# EAGLE design dual_encoder_i2c_revA (EAGLE 8.6.0)
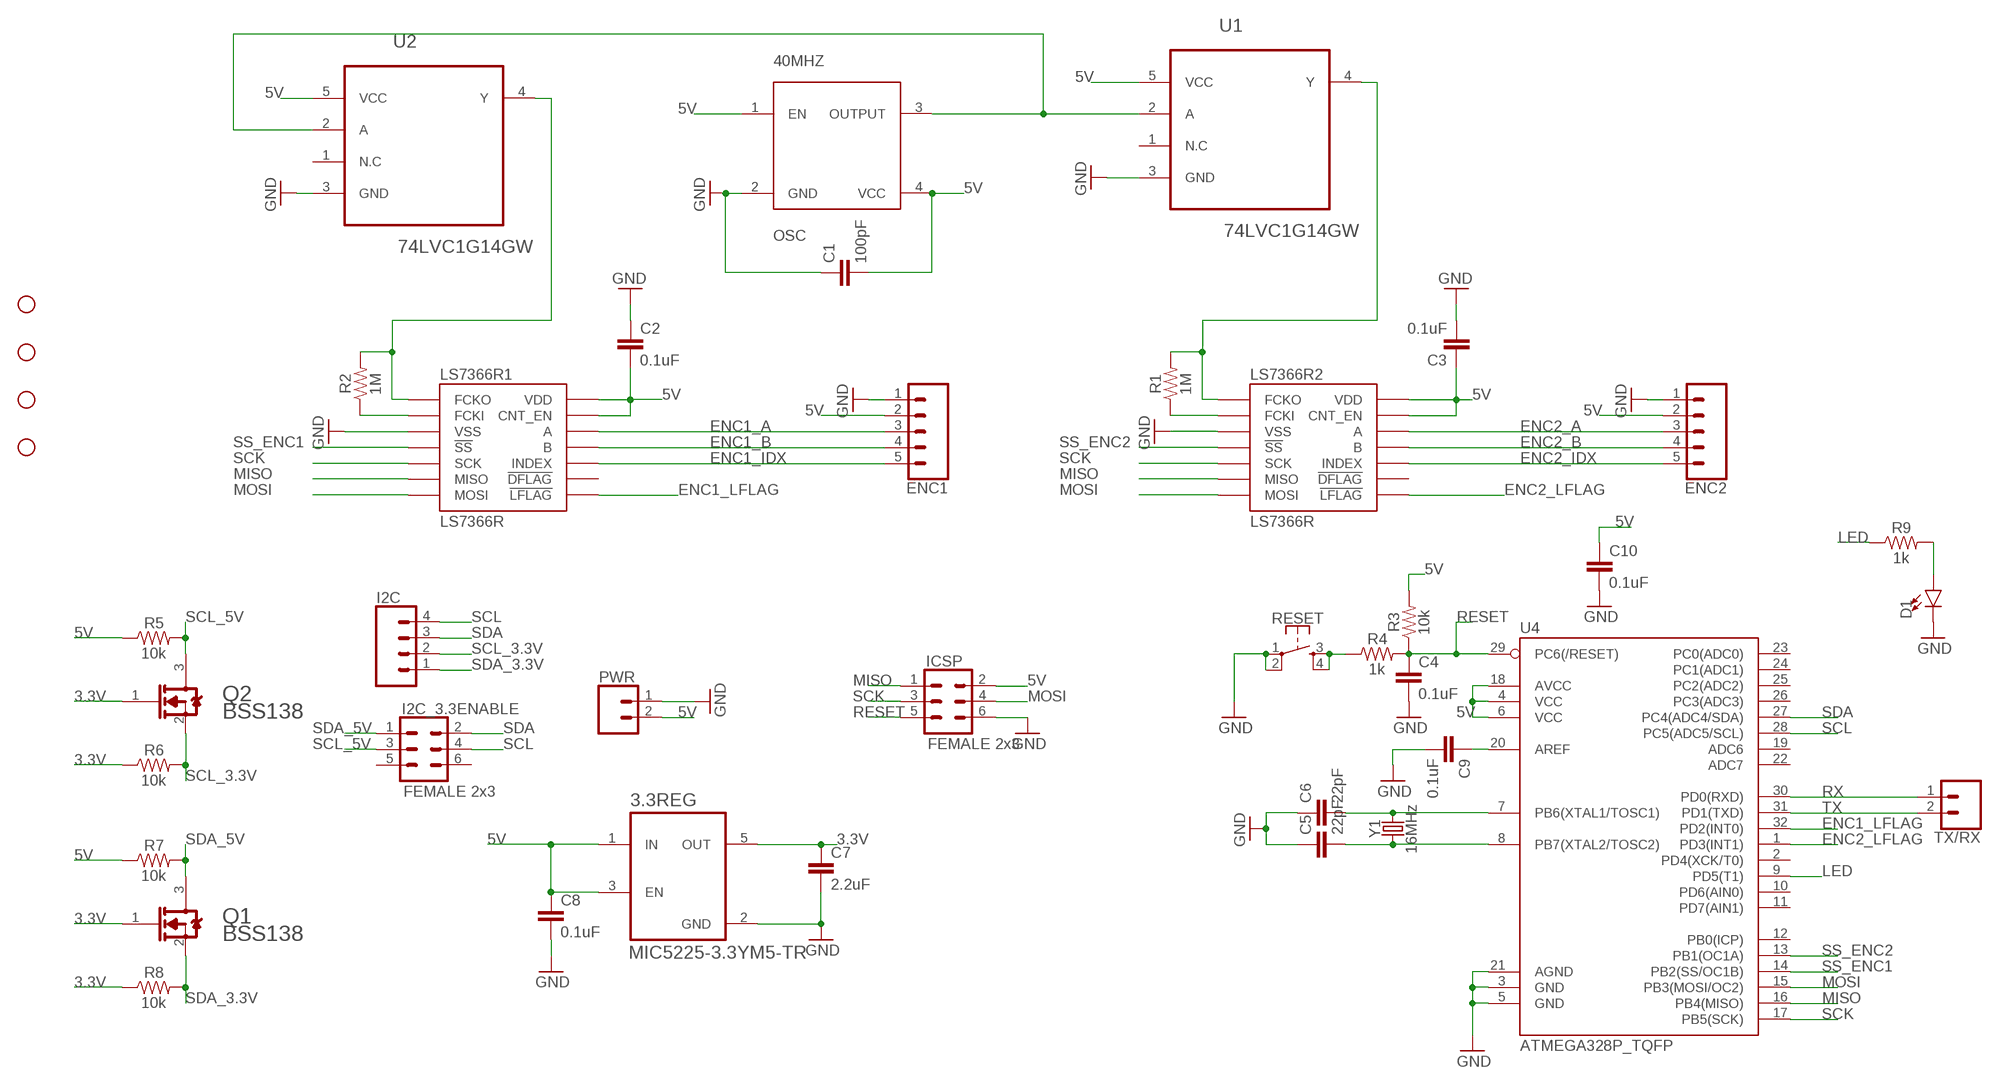
[diagram p0: schematic, sheet 1]

## Parts
3.3REG  MIC5225-3.3YM5-TR  [SOT95P280X145-5N]
40MHZ  OSC  [CB3OSCILLATOR]
C1  100pF  100PF-0603-50V-5%  [0603]
C2  0.1uF  0.1UF-0603-25V-5%  [0603]
C3  0.1uF  0.1UF-0603-25V-5%  [0603]
C4  0.1uF  0.1UF-0603-25V-5%  [0603]
C5  22pF  22PF-0603-50V-5%  [0603]
C6  22pF  22PF-0603-50V-5%  [0603]
C7  2.2uF  2.2UF-0603-10V-20%  [0603]
C8  0.1uF  0.1UF-0603-25V-5%  [0603]
C9  0.1uF  0.1UF-0603-25V-5%  [0603]
C10  0.1uF  0.1UF-0603-25V-5%  [0603]
D1  LED0603  [LED-0603]
ENC1  CONN_05  [1X05]
ENC2  CONN_05  [1X05]
H1  STAND-OFF  [STAND-OFF]
H2  STAND-OFF  [STAND-OFF]
H3  STAND-OFF  [STAND-OFF]
H4  STAND-OFF  [STAND-OFF]
I2C  CONN_04  [1X04]
I2C_3.3ENABLE  FEMALE 2x3  CONN_03X2FEMALE  [2X3]
ICSP  FEMALE 2x3  CONN_03X2FEMALE  [2X3]
LS7366R1  LS7366R  [SOIC14]
LS7366R2  LS7366R  [SOIC14]
PWR  CONN_02-JST-2MM-SMT  [JST-2-SMD]
Q1  ON_SEMI_BSS138ON_SEMI_BSS138_0_0  [ON_SEMI_BSS138_0]
Q2  ON_SEMI_BSS138ON_SEMI_BSS138_0_0  [ON_SEMI_BSS138_0]
R1  1M  1MOHM-0603-1/4W-5%  [0603]
R2  1M  1MOHM-0603-1/4W-5%  [0603]
R3  10k  10KOHM-0603-1/10W-1%  [0603]
R4  1k  1KOHM-0603-1/10W-1%  [0603]
R5  10k  10KOHM-0603-1/10W-1%  [0603]
R6  10k  10KOHM-0603-1/10W-1%  [0603]
R7  10k  10KOHM-0603-1/10W-1%  [0603]
R8  10k  10KOHM-0603-1/10W-1%  [0603]
R9  1k  1KOHM-0603-1/10W-1%  [0603]
RESET  MOMENTARY-SWITCH-SPST-2-SMD-5.2MM  [TACTILE_SWITCH_SMD_5.2MM]
TX/RX  CONN_02  [1X02]
U1  74LVC1G14GW  [SOT65P210X110-5N]
U2  74LVC1G14GW  [SOT65P210X110-5N]
U4  ATMEGA328P_TQFP  [TQFP32-08]
Y1  16MHz  CRYSTAL-16MHZPTH-HC49US  [HC49US]

## Nets
3.3V: 3.3REG.5(OUT) C7.1 Q1.1(G) Q2.1(G) R6.1 R8.1
5V: 3.3REG.1(IN) 3.3REG.3(EN) 40MHZ.1(EN) 40MHZ.4(VCC) C1.2 C2.2 C3.1 C8.1 C10.1 ENC1.2 ENC2.2 ICSP.2 LS7366R1.13(CNT_EN) LS7366R1.14(VDD) LS7366R2.13(CNT_EN) LS7366R2.14(VDD) PWR.2 R3.2 R5.1 R7.1 U1.5(VCC) U2.5(VCC) U4.4(VCC) U4.6(VCC) U4.18(AVCC)
ENC1_A: ENC1.3 LS7366R1.12(A)
ENC1_B: ENC1.4 LS7366R1.11(B)
ENC1_IDX: ENC1.5 LS7366R1.10(INDEX)
ENC1_LFLAG: LS7366R1.8(!LFLAG) U4.32(PD2(INT0))
ENC2_A: ENC2.3 LS7366R2.12(A)
ENC2_B: ENC2.4 LS7366R2.11(B)
ENC2_IDX: ENC2.5 LS7366R2.10(INDEX)
ENC2_LFLAG: LS7366R2.8(!LFLAG) U4.1(PD3(INT1))
GND: 3.3REG.2(GND) 40MHZ.2(GND) C1.1 C2.1 C3.2 C4.2 C5.1 C6.1 C7.2 C8.2 C9.2 C10.2 D1.C ENC1.1 ENC2.1 ICSP.6 LS7366R1.3(VSS) LS7366R2.3(VSS) PWR.1 RESET.1 RESET.2 U1.3(GND) U2.3(GND) U4.3(GND) U4.5(GND) U4.21(AGND)
LED: R9.1 U4.9(PD5(T1))
MISO: ICSP.1 LS7366R1.6(MISO) LS7366R2.6(MISO) U4.16(PB4(MISO))
MOSI: ICSP.4 LS7366R1.7(MOSI) LS7366R2.7(MOSI) U4.15(PB3(MOSI/OC2))
N$1: C9.1 U4.20(AREF)
N$2: R4.1 RESET.3 RESET.4
N$3: D1.A R9.2
N$6: LS7366R1.2(FCKI) R2.1
N$7: 40MHZ.3(OUTPUT) U1.2(A) U2.2(A)
N$8: LS7366R2.1(FCKO) R1.2 U1.4(Y)
N$9: LS7366R2.2(FCKI) R1.1
N$10: LS7366R1.1(FCKO) R2.2 U2.4(Y)
N$12: C6.2 U4.7(PB6(XTAL1/TOSC1)) Y1.2
N$13: C5.2 U4.8(PB7(XTAL2/TOSC2)) Y1.1
RESET: C4.1 ICSP.5 R3.1 R4.2 U4.29(PC6(/RESET))
RX: TX/RX.1 U4.30(PD0(RXD))
SCK: ICSP.3 LS7366R1.5(SCK) LS7366R2.5(SCK) U4.17(PB5(SCK))
SCL: I2C.4 I2C_3.3ENABLE.4 U4.28(PC5(ADC5/SCL))
SCL_3.3V: I2C.2 Q2.2(S) R6.2
SCL_5V: I2C_3.3ENABLE.3 Q2.3(D) R5.2
SDA: I2C.3 I2C_3.3ENABLE.2 U4.27(PC4(ADC4/SDA))
SDA_3.3V: I2C.1 Q1.2(S) R8.2
SDA_5V: I2C_3.3ENABLE.1 Q1.3(D) R7.2
SS_ENC1: LS7366R1.4(!SS) U4.14(PB2(SS/OC1B))
SS_ENC2: LS7366R2.4(!SS) U4.13(PB1(OC1A))
TX: TX/RX.2 U4.31(PD1(TXD))
Unconnected: I2C_3.3ENABLE.5 I2C_3.3ENABLE.6 LS7366R1.9(!DFLAG) LS7366R2.9(!DFLAG) U1.1(N.C) U2.1(N.C) U4.2(PD4(XCK/T0)) U4.10(PD6(AIN0)) U4.11(PD7(AIN1)) U4.12(PB0(ICP)) U4.19(ADC6) U4.22(ADC7) U4.23(PC0(ADC0)) U4.24(PC1(ADC1)) U4.25(PC2(ADC2)) U4.26(PC3(ADC3))

## Library data of the parts
3.3REG = MIC5225-3.3YM5-TR:MIC5225-3.3YM5-TR: MIC5225 Series 150 mA 3.3 V Fixed Output Surface Mount LDO Regulator SOT-23-5; AVAILABILITY: Unavailable; DESCRIPTION: Linear Voltage Regulator IC 1 Output 150mA SOT-23-5; MF: Microchip; MP: MIC5225-3.3YM5-TR; PACKAGE: SOT-23 Microchip; PRICE: None
40MHZ = steveo:OSC: CB3 40mhz Oscillator smd
C1 = SparkFun-Capacitors:100PF: 100pF/0.1nF ceramic capacitors A capacitor is a passive two-terminal electrical component used to store electrical energy temporarily in an electric field.; PROD_ID: CAP-07883
C2-C4 C8-C10 = SparkFun-Capacitors:0.1UF: 0.1µF ceramic capacitors A capacitor is a passive two-terminal electrical component used to store electrical energy temporarily in an electric field.; PROD_ID: CAP-08604
C5 C6 = SparkFun-Capacitors:22PF: 22pF ceramic capacitors A capacitor is a passive two-terminal electrical component used to store electrical energy temporarily in an electric field.; PROD_ID: CAP-07876
C7 = SparkFun-Capacitors:2.2UF: 2.2µF ceramic capacitors A capacitor is a passive two-terminal electrical component used to store electrical energy temporarily in an electric field.; PROD_ID: CAP-07888
D1 = SparkFun-LED:LED: LED (Generic) Standard schematic elements and footprints for 5mm, 3mm, 1206, and 0603 sized LEDs. Generic LEDs with no color specified.
ENC1 ENC2 = SparkFun-Connectors:CONN_05: Multi connection point. Often used as Generic Header-pin footprint for 0.1 inch spaced/style header connections On any of the 0.1 inch spaced packages, you can populate with these: Break Away Headers - Straight <https://www.sparkfun.com/products/116> (PRT-00116) Break Away Male Headers - Right Angle <https://www.sparkfun.com/products/553> (PRT-00553) Female Headers <https://www.sparkfun.com/products/115> (PRT-00115) Break Away Headers - Machine Pin <https://www.sparkfun.com/products/117> (PRT-00117) Break Away Female Headers - Swiss Machine Pin <https://www.sparkfun.com/products/743> (PRT-00743) For SCREWTERMINALS and SPRING TERMINALS visit here: Screw Terimnals on SparkFun.com <https://www.sparkfun.com/search/results?term=Screw+Terminals> (5mm/3.5mm/2.54mm spacing) This device is also useful as a general connection point to wire up your design to another part of your project. Our various solder wires solder well into these plated through hole pads. Hook-Up Wire - Assortment (Stranded, 22 AWG) <https://www.sparkfun.com/products/11375> (PRT-11375) Hook-Up Wire - Assortment (Solid Core, 22 AWG) <https://www.sparkfun.com/products/11367> (PRT-11367) View the entire wire category on our website here <https://www.sparkfun.com/categories/141> Special notes: Molex polarized connector foot print use with SKU : PRT-08231 with associated crimp pins and housings. 1MM SMD Version SKU: PRT-10208
H1-H4 = SparkFun-Hardware:STAND-OFF: Stand Off Drill holes for mechanically mounting via screws, standoffs, etc. Note: Use the keepout ring to avoid running the screw head into surrounding components. Variant Overviews STAND-OFF - Mechanical footprint for a #4 phillips button head screw. STAND-OFF-TIGHT - Mechanical footprint for a #4 phillips button head screw, Example SparkFun Products Screw - Phillips Head (1/4", 4-40, 10 pack) <https://www.sparkfun.com/products/10453> (PRT-10453) Screw - Phillips Head (1/2", 4-40, 10 pack) <https://www.sparkfun.com/products/10452> (PRT-10452) Screw - Phillips Head (3/4", 4-40, 10 pack) <https://www.sparkfun.com/products/10451> (PRT-10451) Screw - Phillips Head (1", 4-40, 10 pack) <https://www.sparkfun.com/products/10450> (PRT-10450)
I2C = SparkFun-Connectors:CONN_04: Multi connection point. Often used as Generic Header-pin footprint for 0.1 inch spaced/style header connections On any of the 0.1 inch spaced packages, you can populate with these: Break Away Headers - Straight <https://www.sparkfun.com/products/116> (PRT-00116) Break Away Male Headers - Right Angle <https://www.sparkfun.com/products/553> (PRT-00553) Female Headers <https://www.sparkfun.com/products/115> (PRT-00115) Break Away Headers - Machine Pin <https://www.sparkfun.com/products/117> (PRT-00117) Break Away Female Headers - Swiss Machine Pin <https://www.sparkfun.com/products/743> (PRT-00743) For SCREWTERMINALS and SPRING TERMINALS visit here: Screw Terimnals on SparkFun.com <https://www.sparkfun.com/search/results?term=Screw+Terminals> (5mm/3.5mm/2.54mm spacing) This device is also useful as a general connection point to wire up your design to another part of your project. Our various solder wires solder well into these plated through hole pads. Hook-Up Wire - Assortment (Stranded, 22 AWG) <https://www.sparkfun.com/products/11375> (PRT-11375) Hook-Up Wire - Assortment (Solid Core, 22 AWG) <https://www.sparkfun.com/products/11367> (PRT-11367) View the entire wire category on our website here <https://www.sparkfun.com/categories/141> Special notes: Molex polarized connector foot print use with SKU : PRT-08231 with associated crimp pins and housings. 1MM SMD Version SKU: PRT-10208; PROD_ID: CONN-09696
I2C_3.3ENABLE ICSP = SparkFun-Connectors:CONN_03X2: Multi connection point. Often used as Generic Header-pin footprint for 0.1 inch spaced/style header connections You can populate with any combo of single row headers, but if you'd like an exact match, check these: Header - 2x3 (Male, 0.1") <https://www.sparkfun.com/products/12807> (PRT-12807) Header - 2x3 (Female, 0.1") <https://www.sparkfun.com/products/13010> (PRT-13010) 2x3 Pin Shrouded Header <https://www.sparkfun.com/products/10877> (PRT-10877) On any of the 0.1 inch spaced packages, you can populate with these: Break Away Headers - Straight <https://www.sparkfun.com/products/116> (PRT-00116) Break Away Male Headers - Right Angle <https://www.sparkfun.com/products/553> (PRT-00553) Female Headers <https://www.sparkfun.com/products/115> (PRT-00115) Break Away Headers - Machine Pin <https://www.sparkfun.com/products/117> (PRT-00117) Break Away Female Headers - Swiss Machine Pin <https://www.sparkfun.com/products/743> (PRT-00743) Special note: the shrouded connector mates well with our 3x2 ribbon cables: Ribbon Crimp Connector - 6-pin (2x3, Female) <https://www.sparkfun.com/products/10651> (PRT-10651) Ribbon Cable - 6 wire (15ft) <https://www.sparkfun.com/products/10646> (PRT-10646); PROD_ID: CONN-11566
LS7366R1 LS7366R2 = LS7366R:LS7366R; AVAILABILITY: Unavailable; MF: LSI; MP: LS7366R; PACKAGE: None; PRICE: None
PWR = SparkFun-Connectors:CONN_02: Multi connection point. Often used as Generic Header-pin footprint for 0.1 inch spaced/style header connections On any of the 0.1 inch spaced packages, you can populate with these: Break Away Headers - Straight <https://www.sparkfun.com/products/116> (PRT-00116) Break Away Male Headers - Right Angle <https://www.sparkfun.com/products/553> (PRT-00553) Female Headers <https://www.sparkfun.com/products/115> (PRT-00115) Break Away Headers - Machine Pin <https://www.sparkfun.com/products/117> (PRT-00117) Break Away Female Headers - Swiss Machine Pin <https://www.sparkfun.com/products/743> (PRT-00743) For SCREWTERMINALS and SPRING TERMINALS visit here: Screw Terimnals on SparkFun.com <https://www.sparkfun.com/search/results?term=Screw+Terminals> (5mm/3.5mm/2.54mm spacing) This device is also useful as a general connection point to wire up your design to another part of your project. Our various solder wires solder well into these plated through hole pads. Hook-Up Wire - Assortment (Stranded, 22 AWG) <https://www.sparkfun.com/products/11375> (PRT-11375) Hook-Up Wire - Assortment (Solid Core, 22 AWG) <https://www.sparkfun.com/products/11367> (PRT-11367) View the entire wire category on our website here <https://www.sparkfun.com/categories/141> Special notes: Molex polarized connector foot print use with: PRT-08233 with associated crimp pins and housings. 2.54_SCREWTERM for use with PRT-10571. 3.5mm Screw Terminal footprints for PRT-08084 5mm Screw Terminal footprints for use with PRT-08432; PROD_ID: CONN-11443
Q1 Q2 = ON Semi - BSS138:ON_SEMI_BSS138: N-Channel Logic Level Enhancement Mode Field Effect Transistor; CENTROID_NOT_SPECIFIED: No; DATASHEET: https://www.fairchildsemi.com/datasheets/BS/BSS138.pdf; DIGIKEY_DESCRIPTION: TRANS MOSFET N-CH 50V 220MA SOT-23; DIGIKEY_PART_NUMBER: BSS138CT-ND; LEAD_FREE: yes; MF: ON Semi; MFG_PACKAGE_IDENT: BSS138; MFG_PACKAGE_IDENT_DATE: 0; MFG_PACKAGE_IDENT_REV: 0; MOUSER_DESCRIPTION: MOSFET SOT-23 N-CH LOGIC; MOUSER_PART_NUMBER: 512-BSS138; MPN: BSS138; PACKAGE: SOT23; PREFIX: Q; ROHS: yes; TEMPERATURE_RANGE_HIGH: +150°C; TEMPERATURE_RANGE_LOW: -55°C
R1 R2 = SparkFun-Resistors:1MOHM: 1MΩ resistor A resistor is a passive two-terminal electrical component that implements electrical resistance as a circuit element. Resistors act to reduce current flow, and, at the same time, act to lower voltage levels within circuits. - Wikipedia; PROD_ID: RES-07868
R3 R5-R8 = SparkFun-Resistors:10KOHM: 10kΩ resistor A resistor is a passive two-terminal electrical component that implements electrical resistance as a circuit element. Resistors act to reduce current flow, and, at the same time, act to lower voltage levels within circuits. - Wikipedia; PROD_ID: RES-00824
R4 R9 = SparkFun-Resistors:1KOHM: 1kΩ resistor A resistor is a passive two-terminal electrical component that implements electrical resistance as a circuit element. Resistors act to reduce current flow, and, at the same time, act to lower voltage levels within circuits. - Wikipedia; PROD_ID: RES-07856
RESET = SparkFun-Switches:MOMENTARY-SWITCH-SPST-2: Momentary Switch (Pushbutton) - SPST - Two Circuits Normally-open (NO) SPST momentary switches (buttons, pushbuttons). Schematic symbol includes two switch circuits. Variants SMD-4.6MMX2.8MM - 4.60mm x 2.80mm Tactile Momentary Button Switch - Used on SparkFun SAMD21 Mini Breakout <https://www.sparkfun.com/products/13664> SMD-5.2MM - Mini Pushbutton Switch - SMD <https://www.sparkfun.com/products/8720> - Used on Arduino Pro Mini <https://www.sparkfun.com/products/11114>; PROD_ID: SWCH-08247; SF_SKU: COM-08720
TX/RX = SparkFun-Connectors:CONN_02: Multi connection point. Often used as Generic Header-pin footprint for 0.1 inch spaced/style header connections On any of the 0.1 inch spaced packages, you can populate with these: Break Away Headers - Straight <https://www.sparkfun.com/products/116> (PRT-00116) Break Away Male Headers - Right Angle <https://www.sparkfun.com/products/553> (PRT-00553) Female Headers <https://www.sparkfun.com/products/115> (PRT-00115) Break Away Headers - Machine Pin <https://www.sparkfun.com/products/117> (PRT-00117) Break Away Female Headers - Swiss Machine Pin <https://www.sparkfun.com/products/743> (PRT-00743) For SCREWTERMINALS and SPRING TERMINALS visit here: Screw Terimnals on SparkFun.com <https://www.sparkfun.com/search/results?term=Screw+Terminals> (5mm/3.5mm/2.54mm spacing) This device is also useful as a general connection point to wire up your design to another part of your project. Our various solder wires solder well into these plated through hole pads. Hook-Up Wire - Assortment (Stranded, 22 AWG) <https://www.sparkfun.com/products/11375> (PRT-11375) Hook-Up Wire - Assortment (Solid Core, 22 AWG) <https://www.sparkfun.com/products/11367> (PRT-11367) View the entire wire category on our website here <https://www.sparkfun.com/categories/141> Special notes: Molex polarized connector foot print use with: PRT-08233 with associated crimp pins and housings. 2.54_SCREWTERM for use with PRT-10571. 3.5mm Screw Terminal footprints for PRT-08084 5mm Screw Terminal footprints for use with PRT-08432
U1 U2 = 74LVC1G14GW:74LVC1G14GW: Single Schmitt-trigger inverter; AVAILABILITY: Unavailable; DESCRIPTION: IC MOS 74LVC1G14/SO/74LVC1G14GW PHILIPS RoHS LVC SOt23; MF: NXP Semiconductors; MP: 74LVC1G14GW; PACKAGE: TSSOP-5 NXP Semiconductors; PRICE: 214.47 USD
U4 = SparkFun-IC-Microcontroller:ATMEGA328P_TQFP: Popular 328P in QFP Storefront component: ATmega328 - TQFP <https://www.sparkfun.com/products/13448> (COM-13448) Datasheet <http://www.sparkfun.com/datasheets/Components/SMD/ATMega328.pdf> SparkFun Products SparkFun RedBoard - Programmed with Arduino <https://www.sparkfun.com/products/12757> (DEV-12757) Arduino Pro Mini 328 - 5V/16MHz <https://www.sparkfun.com/products/11113> (DEV-11113) Arduino Pro Mini 328 - 3.3V/8MHz <https://www.sparkfun.com/products/11114> (DEV-11114) SparkFun OpenLog <https://www.sparkfun.com/products/13712> (DEV-13712) SparkFun MicroView - OLED Arduino Module <https://www.sparkfun.com/products/12923> (DEV-12923) SparkFun Digital Sandbox <https://www.sparkfun.com/products/12651> (DEV-12651) SparkFun PicoBoard <https://www.sparkfun.com/products/11888> (WIG-11888) Arduino Fio <https://www.sparkfun.com/products/10116> (DEV-10116) LilyPad Arduino 328 Main Board <https://www.sparkfun.com/products/13342> (DEV-13342) SparkFun RedStick <https://www.sparkfun.com/products/13741> (DEV-13741) LilyPad MP3 <https://www.sparkfun.com/products/11013> (DEV-11013) LilyPad Arduino SimpleSnap <https://www.sparkfun.com/products/10941> (DEV-10941) SparkFun Stepoko <https://www.sparkfun.com/products/13899> (ROB-13899) SparkFun Geiger Counter <https://www.sparkfun.com/products/11345> (SEN-11345) SparkFun EL Sequencer <https://www.sparkfun.com/products/12781> (COM-12781) Arduino Pro 328 - 5V/16MHz <https://www.sparkfun.com/products/10915> (DEV-10915) CryptoCape <https://www.sparkfun.com/products/12773> (DEV-12773) SparkFun IR Thermometer Evaluation Board - MLX90614 <https://www.sparkfun.com/products/10740> (SEN-10740) SparkFun RedBot Mainboard <https://www.sparkfun.com/products/12097> (ROB-12097) Arduino Pro 328 - 3.3V/8MHz <https://www.sparkfun.com/products/10914> (DEV-10914) SparkFun Block for Intel® Edison - Arduino <https://www.sparkfun.com/products/13036> (DEV-13036) SparkFun Simon Says - Surface Mount Soldering Kit <https://www.sparkfun.com/products/10935> (KIT-10935) SparkFun 7-Segment Serial Display - Red <https://www.sparkfun.com/products/11441> (COM-11441) SparkFun 7-Segment Serial Display - White <https://www.sparkfun.com/products/11629> (COM-11629) SparkFun 7-Segment Serial Display - Yellow <https://www.sparkfun.com/products/11443> (COM-11443) SparkFun 7-Segment Serial Display - Kelly Green <https://www.sparkfun.com/products/11440> (COM-11440) SparkFun 7-Segment Serial Display - Blue <https://www.sparkfun.com/products/11442> (COM-11442) SparkFun OpenSegment Serial Display - 20mm (Blue) <https://www.sparkfun.com/products/11647> (COM-11647) SparkFun OpenSegment Serial Display - 20mm (Green) <https://www.sparkfun.com/products/11646> (COM-11646) SparkFun OpenSegment Serial Display - 20mm (White) <https://www.sparkfun.com/products/11648> (COM-11648) SparkFun OpenSegment Serial Display - 20mm (Red) <https://www.sparkfun.com/products/11644> (COM-11644) SparkFun OpenSegment Serial Display - 20mm (Yellow) <https://www.sparkfun.com/products/11645> (COM-11645) SparkFun OpenSegment Shield <https://www.sparkfun.com/products/13190> (DEV-13190); PROD_ID: IC-09069
Y1 = SparkFun-Clocks:CRYSTAL-16MHZ: 16MHz Crystal Digikey Example <http://www.digikey.com/product-search/en?keywords=535-9122-1-ND> Frequency: 16MHz Frequency Stability: ±50ppm Frequency Tolerance: ±20ppm Load Capacitance: 18pF SparkFun Products: Pro Micro -5V/16MHz <https://www.sparkfun.com/products/12640> SparkFun Serial Enabled LCD Kit <https://www.sparkfun.com/products/10097>; PROD_ID: XTAL-08181; SF_ID: COM-00536

## Board
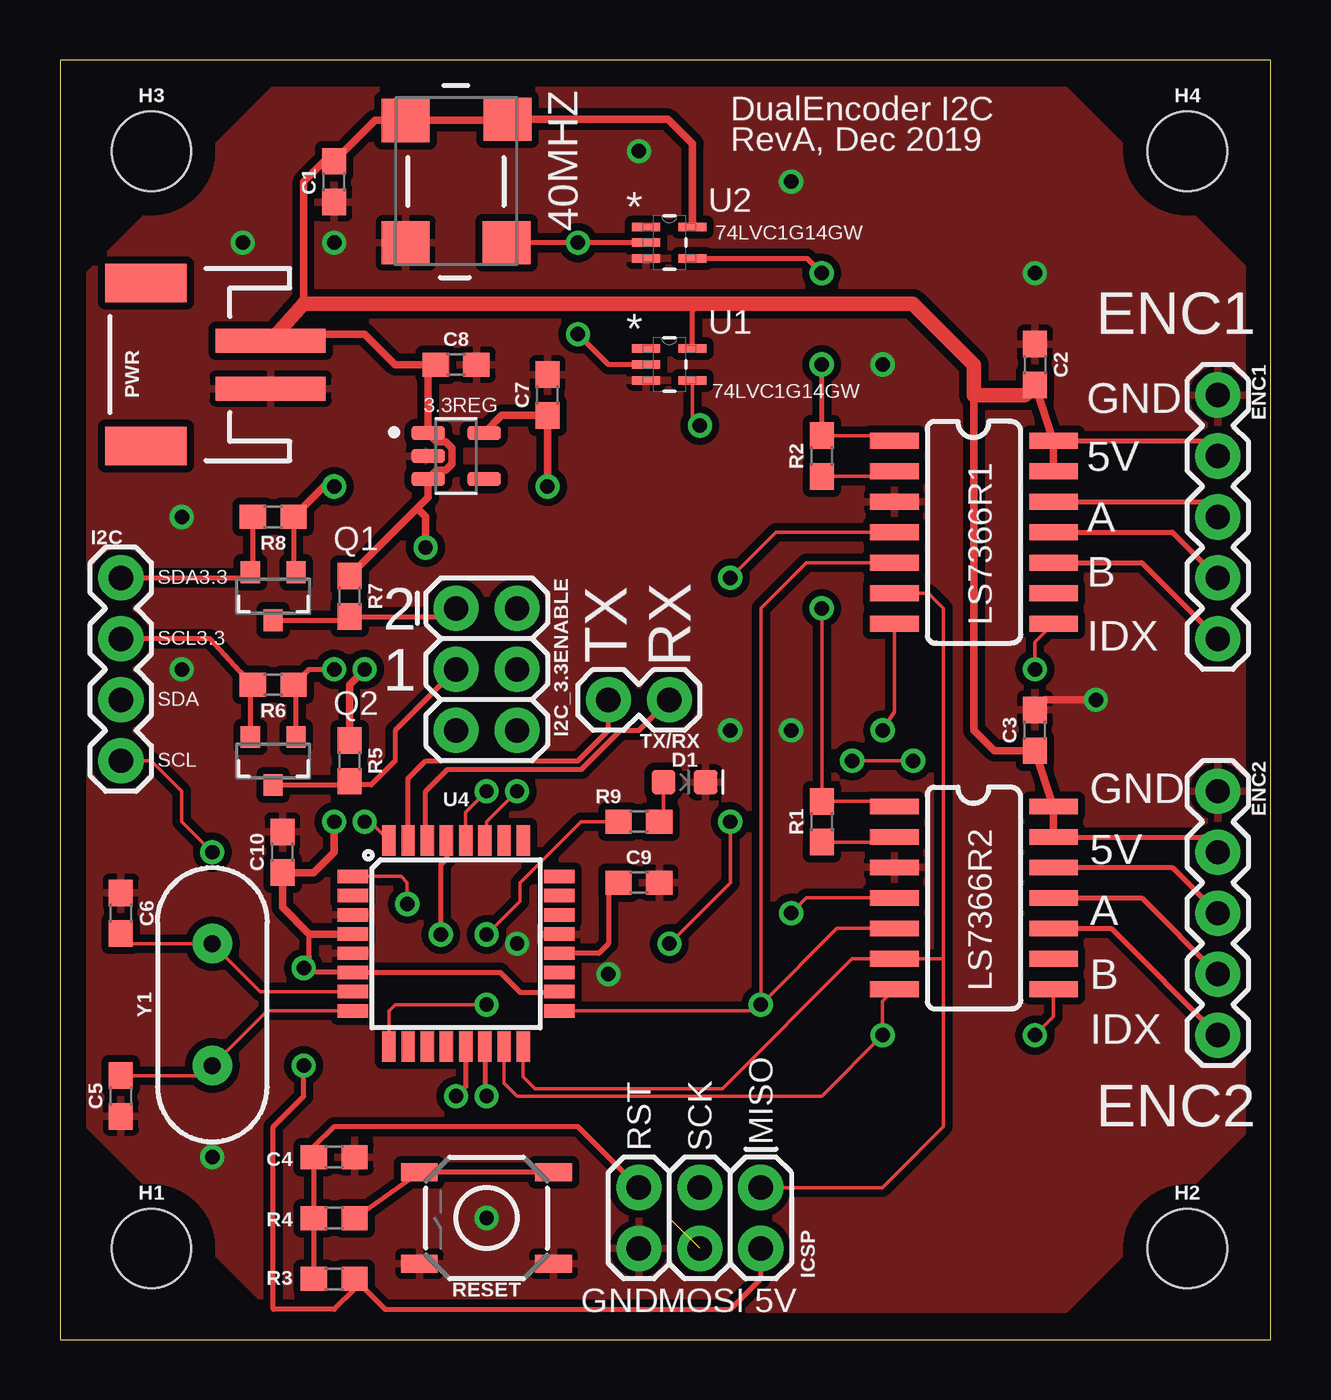
[diagram p1: board, top side]
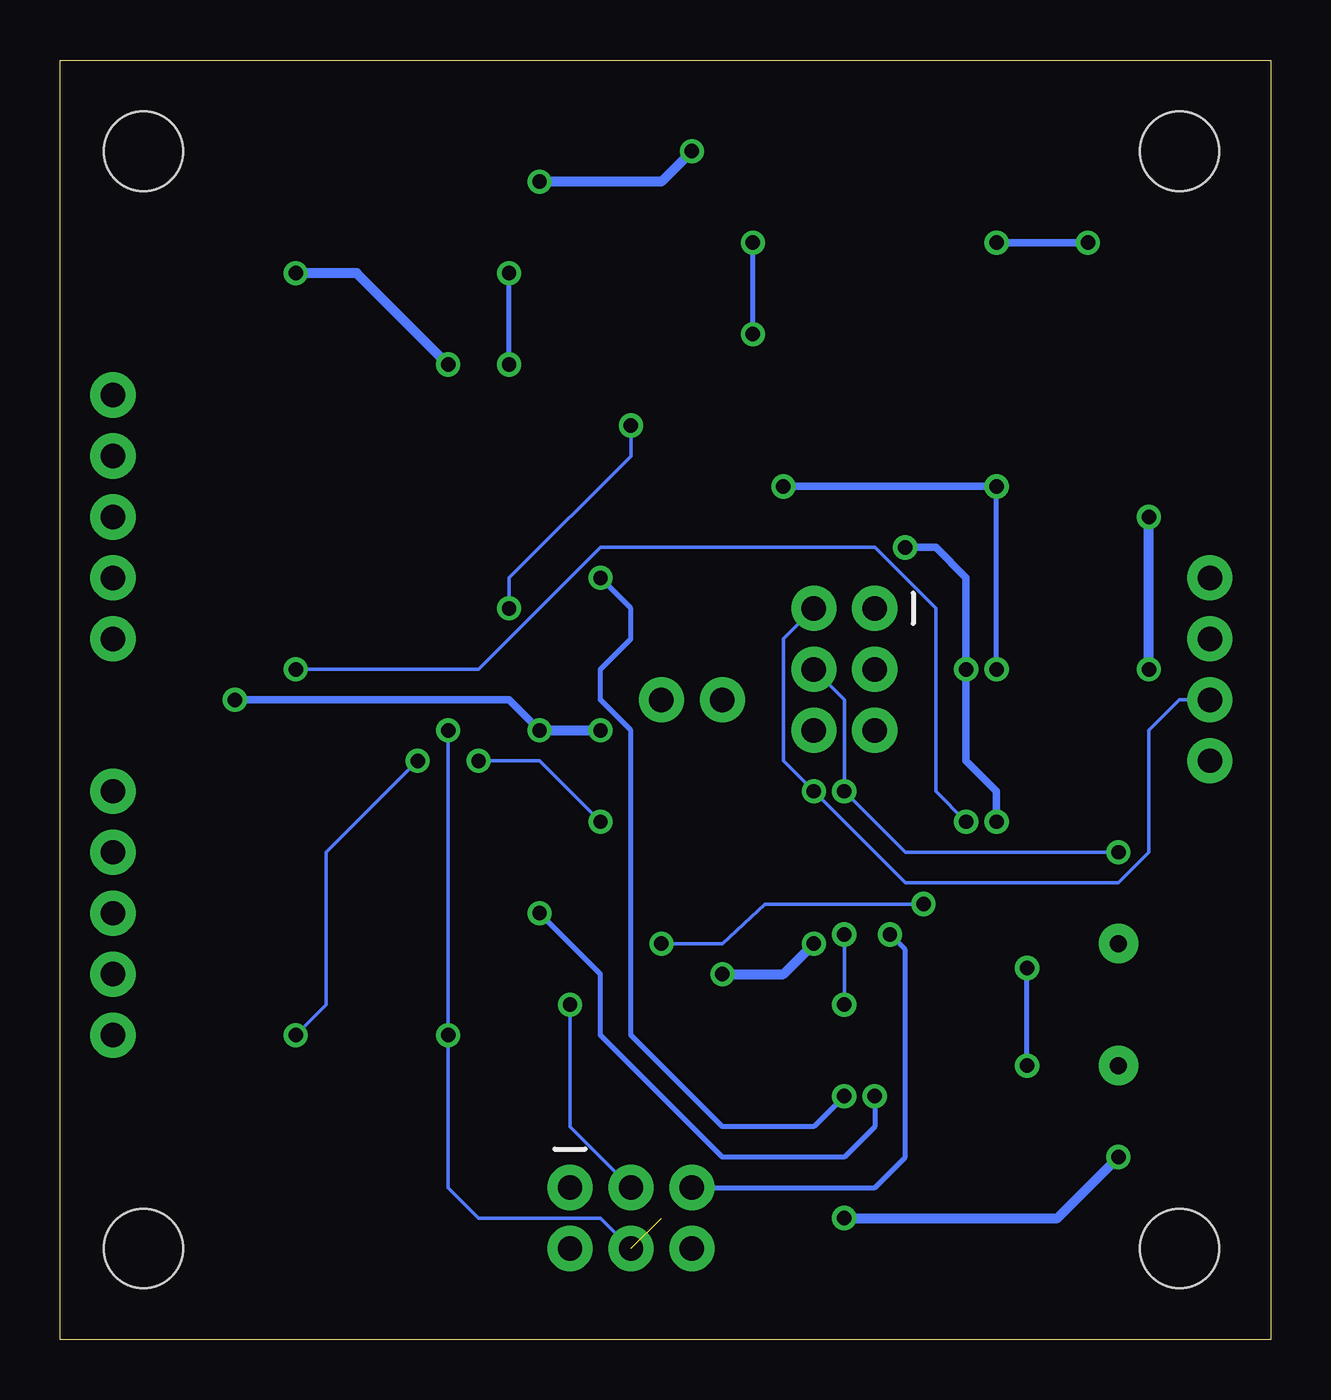
[diagram p2: board, bottom side, seen from below]

Size 50.47 x 53.33 mm. Coordinates in mm from the lower left corner, seen from the top.
Outline: 0,0 50.47,0 50.47,53.33 0,53.33 0,0
Copper layers (1*16): Top 0.035mm / dielectric 1.5mm / Bottom 0.035mm
Design rules "default": minimum track width 6mil, minimum drill 0.35mm, track to track 6mil, track to pad 6mil, pad to pad 6mil, via to via 6mil, smd to smd 6mil, copper to edge 40mil, drill to drill 6mil, minimum pad ring 10mil, minimum via ring 8mil, stop-mask expansion 4mil, vias tented up to drill 0mil, thermal gap 10mil

### Footprints (pad centres in the part's own frame; a part is rotated, then mirrored left to right if it is on the bottom)
SOT95P280X145-5N = smd 1.39 x 0.58: 1 -1.165,0.95; 2 -1.165,0; 3 -1.165,-0.95; 4 1.165,-0.95; 5 1.165,0.95
CB3OSCILLATOR = smd 1.8 x 2: 1 -2.55,-2.1; 2 2.55,-2.1; 3 2.55,2.1; 4 -2.6,2.15
0603 = smd 1.1 x 1: 1 -0.85,0; 2 0.85,0
LED-0603 = smd 1 x 1: A -0.877,0; C 0.877,0
1X05 = drill 1.016 pad 1.88: 1 0,0; 2 2.54,0; 3 5.08,0; 4 7.62,0; 5 10.16,0
STAND-OFF = hole 3.302: 0,0
1X04 = drill 1.016 pad 1.88: 1 0,0; 2 2.54,0; 3 5.08,0; 4 7.62,0
2X3 = drill 1.016 pad 1.88: 1 0,0; 2 0,2.54; 3 2.54,0; 4 2.54,2.54; 5 5.08,0; 6 5.08,2.54
SOIC14 = smd 2.032 x 0.66: 1 -3.315,4.445; 2 -3.315,3.175; 3 -3.315,1.905; 4 -3.315,0.635; 5 -3.315,-0.635; 6 -3.315,-1.905; 7 -3.315,-3.175; 8 3.315,-3.175; 9 3.315,-1.905; 10 3.315,-0.635; 11 3.315,0.635; 12 3.315,1.905; 13 3.315,3.175; 14 3.315,4.445
JST-2-SMD = smd 1 x 4.6: 1 -1,-3.7; 2 1,-3.7 | smd 1.6 x 3.4: NC1 -3.4,1.5; NC2 3.4,1.5
ON_SEMI_BSS138_0 = smd 0.8 x 0.9: 1 -0.95,-1; 2 0.95,-1; 3 0,1
TACTILE_SWITCH_SMD_5.2MM = smd 1.524 x 0.762: 1 -2.794,1.905; 2 2.794,1.905; 3 -2.794,-1.905; 4 2.794,-1.905
1X02 = drill 1.016 pad 1.88: 1 0,0; 2 2.54,0
SOT65P210X110-5N = smd 1.168 x 0.356: 1 -0.965,0.66; 2 -0.965,0; 3 -0.965,-0.66; 4 0.965,-0.66; 5 0.965,0.66
TQFP32-08 = smd 1.27 x 0.559: 1 -4.293,2.8; 2 -4.293,2; 3 -4.293,1.2; 4 -4.293,0.4; 5 -4.293,-0.4; 6 -4.293,-1.2; 7 -4.293,-2; 8 -4.293,-2.8; 17 4.293,-2.8; 18 4.293,-2; 19 4.293,-1.2; 20 4.293,-0.4; 21 4.293,0.4; 22 4.293,1.2; 23 4.293,2; 24 4.293,2.8 | smd 0.559 x 1.27: 9 -2.8,-4.293; 10 -2,-4.293; 11 -1.2,-4.293; 12 -0.4,-4.293; 13 0.4,-4.293; 14 1.2,-4.293; 15 2,-4.293; 16 2.8,-4.293; 25 2.8,4.293; 26 2,4.293; 27 1.2,4.293; 28 0.4,4.293; 29 -0.4,4.293; 30 -1.2,4.293; 31 -2,4.293; 32 -2.8,4.293
HC49US = drill 0.7 pad 1.651: 1 -2.54,0; 2 2.54,0

### Placement (x,y rotation side)
3.3REG  16.51,36.83 0 top
40MHZ  16.51,48.26 270 top
C1  11.43,48.26 90 top
C2  40.64,40.64 270 top
C3  40.64,25.4 90 top
C4  11.43,7.62 0 top
C5  2.54,10.16 90 top
C6  2.54,17.78 270 top
C7  20.32,39.37 90 top
C8  16.51,40.64 0 top
C9  24.13,19.05 0 top
C10  9.27,20.32 90 top
D1  26.04,23.24 0 top
ENC1  48.26,39.37 270 top
ENC2  48.26,22.86 270 top
H1  3.81,3.81 0 top
H2  46.99,3.81 0 top
H3  3.81,49.53 0 top
H4  46.99,49.53 0 top
I2C  2.54,31.75 270 top
I2C_3.3ENABLE  16.51,30.48 270 top
ICSP  29.21,6.35 180 top
LS7366R1  38.1,33.02 0 top
LS7366R2  38.1,17.78 0 top
PWR  5.08,40.64 90 top
Q1  8.89,30.99 180 top
Q2  8.89,24.13 180 top
R1  31.75,21.59 90 top
R2  31.75,36.83 90 top
R3  11.43,2.54 0 top
R4  11.43,5.08 180 top
R5  12.06,24.13 270 top
R6  8.89,27.3 180 top
R7  12.06,30.99 270 top
R8  8.89,34.29 180 top
R9  24.13,21.59 0 top
RESET  17.78,5.08 180 top
TX/RX  25.4,26.67 180 top
U1  25.4,40.64 0 top
U2  25.4,45.72 0 top
U4  16.51,16.51 0 top
Y1  6.35,13.97 90 top

### Tracks (layer width: path | path; a pad name or v marks a point on that pad's centre or on a via)
3.3V  (via drill 0.6)
  Top 0.203: R8.1 9.74,32.09 Q1.1 | Q2.1 9.84,27.2 R6.1 10.38,27.94 v11.43,27.94
  Top 0.305: 3.3REG.5 18.41,38.52 C7.1 v20.32,35.56 | R8.1 11.01,35.56 v11.43,35.56
  Bottom 0.203: v11.43,27.94 v11.43,35.56
  Bottom 0.305: v11.43,35.56 v20.32,35.56
5V  (via drill 0.6)
  Top 0.203: LS7366R1.14 47.62,37.47 ENC1.2 | LS7366R2.13 47.62,20.95 ENC2.2 | ICSP.2 29.21,2.54 27.94,1.27 13.55,1.27 R3.2 12.28,2.12 11.43,1.27 8.89,1.27 8.89,8.89 10.16,10.16 v10.16,11.43 | U1.5 26.36,42.88 26.67,43.18 | 10.39,16.91 10.39,15.98 v10.16,15.49 10.34,15.31 U4.6 18.34,15.31 19.18,14.48 20.77,14.48 U4.18
  Top 0.305: LS7366R2.13 LS7366R2.14 C3.1 38.95,24.55 38.1,25.4 38.1,39.37 | LS7366R1.13 LS7366R1.14 C2.2 | PWR.2 9.05,41.91 12.7,41.91 13.97,40.64 C8.1 15.35,40.33 3.3REG.1 15.7,37.42 16.08,37.42 16.34,37.16 16.34,36.5 16.08,36.23 15.7,36.23 3.3REG.3 15.35,35.12 14.88,34.65 | R7.1 14.88,34.65 | U4.4 10.39,16.91 9.27,18.03 C10.1 10.58,19.47 11.43,20.32 v11.43,21.59 | R5.1 12.06,27.3 v12.7,27.94 | v15.24,33.02 15.24,34.29 14.88,34.65 | 10.16,43.18 10.16,48.26 11.01,49.11 C1.2 13.13,50.81 40MHZ.1 18.61,50.81 40MHZ.4 25.34,50.86 26.36,49.84 U2.5
  Top 0.61: PWR.2 10.16,43.18 26.67,43.18 35.56,43.18 38.1,40.64 38.1,39.37 40.22,39.37 C2.2
  Bottom 0.203: v10.16,11.43 v10.16,15.49
  Bottom 0.305: v15.24,33.02 13.97,33.02 12.7,31.75 v12.7,27.94 12.7,24.13 11.43,22.86 v11.43,21.59
ENC1_A
  Top 0.203: LS7366R1.12 47.62,34.92 ENC1.3
ENC1_B
  Top 0.203: LS7366R1.11 46.35,33.66 ENC1.4
ENC1_IDX
  Top 0.203: LS7366R1.10 45.09,32.38 ENC1.5
ENC1_LFLAG  (via drill 0.6)
  Top 0.152: U4.32 12.92,21.59 v12.7,21.59 | v40.64,27.94 40.64,29.07 LS7366R1.8
  Bottom 0.152: v12.7,21.59 13.97,22.86 13.97,30.48 16.51,33.02 27.94,33.02 33.02,27.94 v40.64,27.94
ENC2_A
  Top 0.203: LS7366R2.12 46.35,19.68 ENC2.3
ENC2_B
  Top 0.203: LS7366R2.11 45.09,18.41 ENC2.4
ENC2_IDX
  Top 0.203: LS7366R2.10 43.81,17.14 ENC2.5
ENC2_LFLAG  (via drill 0.6)
  Top 0.152: U4.1 14.22,19.31 14.48,19.05 v14.48,18.16 | v25.4,16.51 27.94,19.05 v27.94,21.59 | v33.02,24.13 v35.56,24.13 | v40.64,12.7 41.41,13.47 LS7366R2.8
  Bottom 0.152: v14.48,18.16 21.08,18.16 22.86,16.51 v25.4,16.51 | v27.94,21.59 30.48,24.13 v33.02,24.13 | v35.56,24.13 39.37,20.32 39.37,13.97 v40.64,12.7
GND  (via drill 0.6)
  Top 0.305: C3.2 41.06,26.67 v43.18,26.67
  Bottom 0.305: v43.18,26.67 31.75,26.67 v30.48,25.4 | v11.43,45.72 v7.62,45.72
  Bottom 0.406: v22.86,15.24 20.32,15.24 v19.05,16.51 | v34.29,40.64 38.1,44.45 v40.64,44.45 | v24.13,49.53 25.4,48.26 v30.48,48.26 | v17.78,5.08 8.89,5.08 v6.35,7.62 | v30.48,25.4 v27.94,25.4 | v5.08,27.94 v5.08,34.29
  pour Top (isolate 0.305): 1.27,44.45 8.89,52.07 41.91,52.07 49.53,44.45 49.53,8.89 41.91,1.27 8.89,1.27 1.27,8.89
LED  (via drill 0.6)
  Top 0.152: U4.9 13.71,13.71 13.97,13.97 v17.78,13.97 | v17.78,16.89 19.18,18.29 19.18,19.05 21.72,21.59 R9.1
  Bottom 0.152: v17.78,13.97 v17.78,16.89
MISO
  Top 0.152: U4.16 19.31,10.97 19.81,10.46 27.61,10.46 33.02,15.88 LS7366R2.6 36.83,15.88 | 36.83,15.88 36.83,8.89 34.29,6.35 ICSP.1 | 36.83,15.88 36.83,30.48 36.2,31.11 LS7366R1.6
MOSI  (via drill 0.6)  (1 unrouted)
  Top 0.152: U4.15 18.51,10.7 19.05,10.16 31.75,10.16 v34.29,12.7 34.29,14.11 LS7366R2.7 | v34.29,25.4 34.78,26.18 LS7366R1.7
  Bottom 0.152: ICSP.4 27.94,5.08 33.02,5.08 34.29,6.35 v34.29,12.7 v34.29,25.4
N$1
  Top 0.203: C9.1 22.86,18.63 22.86,16.51 22.46,16.11 U4.20
N$2
  Top 0.203: R4.1 RESET.4 RESET.3
N$3
  Top 0.152: R9.2 25.16,21.77 D1.A
N$6
  Top 0.152: R2.1 34.57,35.98 LS7366R1.2
N$7  (via drill 0.6)
  Top 0.203: U2.2 v21.59,45.72 40MHZ.3 | U1.2 22.86,40.64 v21.59,41.91
  Bottom 0.203: v21.59,41.91 v21.59,45.72
N$8  (via drill 0.6)
  Top 0.152: LS7366R2.1 34.57,22.44 R1.2 v31.75,30.48 | v26.67,38.1 26.36,38.41 U1.4
  Bottom 0.152: v31.75,30.48 31.75,31.75 26.67,36.83 v26.67,38.1
N$9
  Top 0.152: R1.1 34.57,20.74 LS7366R2.2
N$10  (via drill 0.6)
  Top 0.152: R2.2 34.57,37.68 LS7366R1.1
  Top 0.203: R2.2 v31.75,40.64 | U2.4 31.14,45.06 v31.75,44.45
  Bottom 0.203: v31.75,40.64 v31.75,44.45
N$12
  Top 0.152: C6.2 2.96,16.51 Y1.2 8.35,14.51 U4.7
N$13
  Top 0.152: C5.2 5.93,11.01 Y1.1 8.63,13.71 U4.8
RESET  (via drill 0.6)
  Top 0.203: R3.1 R4.2 C4.1 10.58,8.04 11.43,8.89 21.59,8.89 ICSP.5 | v15.88,16.89 15.88,19.81 16.13,20.07 16.13,20.78 U4.29
  Bottom 0.203: ICSP.5 16.51,6.35 15.24,7.62 15.24,16.26 v15.88,16.89
RX
  Top 0.203: U4.30 15.24,20.87 15.24,22.86 16.15,23.77 21.74,23.77 23.36,25.4 24.13,25.4 TX/RX.1
SCK  (via drill 0.6)
  Top 0.152: U4.17 28.95,13.71 v29.21,13.97 | LS7366R1.5 31.11,32.38 29.21,30.48 v29.21,13.97 | LS7366R2.5 32.38,17.14 v29.21,13.97
  Bottom 0.152: ICSP.3 29.21,8.89 v29.21,13.97
SCL  (via drill 0.6)
  Top 0.152: U4.28 16.91,21.99 v17.78,22.86 | v6.35,20.32 5.08,21.59 5.08,22.86 3.81,24.13 I2C.4
  Bottom 0.152: I2C_3.3ENABLE.4 17.78,26.67 v17.78,22.86 15.24,20.32 v6.35,20.32
SCL_3.3V
  Top 0.203: R6.2 7.94,27.41 | I2C.2 6.26,29.21 7.51,27.83 7.94,27.41 | Q2.2 7.94,27.41
SCL_5V
  Top 0.203: Q2.3 11.91,23.13 | 11.91,23.13 R5.2 | I2C_3.3ENABLE.3 13.97,25.4 13.97,24.13 12.97,23.13 11.91,23.13
SDA  (via drill 0.6)
  Top 0.152: U4.27 17.78,20.87 17.78,21.59 v19.05,22.86
  Bottom 0.152: I2C_3.3ENABLE.2 20.32,29.21 20.32,24.13 v19.05,22.86 15.24,19.05 6.35,19.05 5.08,20.32 5.08,25.4 3.81,26.67 I2C.3
SDA_3.3V
  Top 0.203: R8.2 8.04,32.09 Q1.2 7.7,31.75 I2C.1
SDA_5V
  Top 0.203: Q1.3 11.91,29.99 R7.2 16.17,30.14 I2C_3.3ENABLE.1
SS_ENC1  (via drill 0.6)
  Top 0.152: v27.94,31.75 29.84,33.66 LS7366R1.4
  Top 0.203: U4.14 17.71,10.23 v17.78,10.16
  Bottom 0.203: v17.78,10.16 19.05,8.89 22.86,8.89 26.67,12.7 26.67,25.4 27.94,26.67 27.94,27.94 26.67,29.21 26.67,30.48 v27.94,31.75
SS_ENC2  (via drill 0.6)
  Top 0.152: v30.48,17.78 31.11,18.41 LS7366R2.4
  Top 0.203: U4.13 16.91,10.56 v16.51,10.16
  Bottom 0.203: v16.51,10.16 16.51,8.89 17.78,7.62 22.86,7.62 27.94,12.7 27.94,15.24 v30.48,17.78
TX
  Top 0.203: U4.31 14.51,23.4 15.24,24.13 21.59,24.13 22.86,25.4 TX/RX.2

### Text on the board
tPlace: DualEncoder I2C | RevA, Dec 2019 | 74LVC1G14GW | ENC1 | 74LVC1G14GW | GND | 5V | A | SDA3.3 | B | 2 | SCL3.3 | IDX | TX | RX | 1 | SDA | SCL | GND | 5V | A | B | IDX | ENC2 | RST | SCK | MISO | GND | MOSI | 5V